# Altium project TRAFFIC LIGHT.PrjPCB
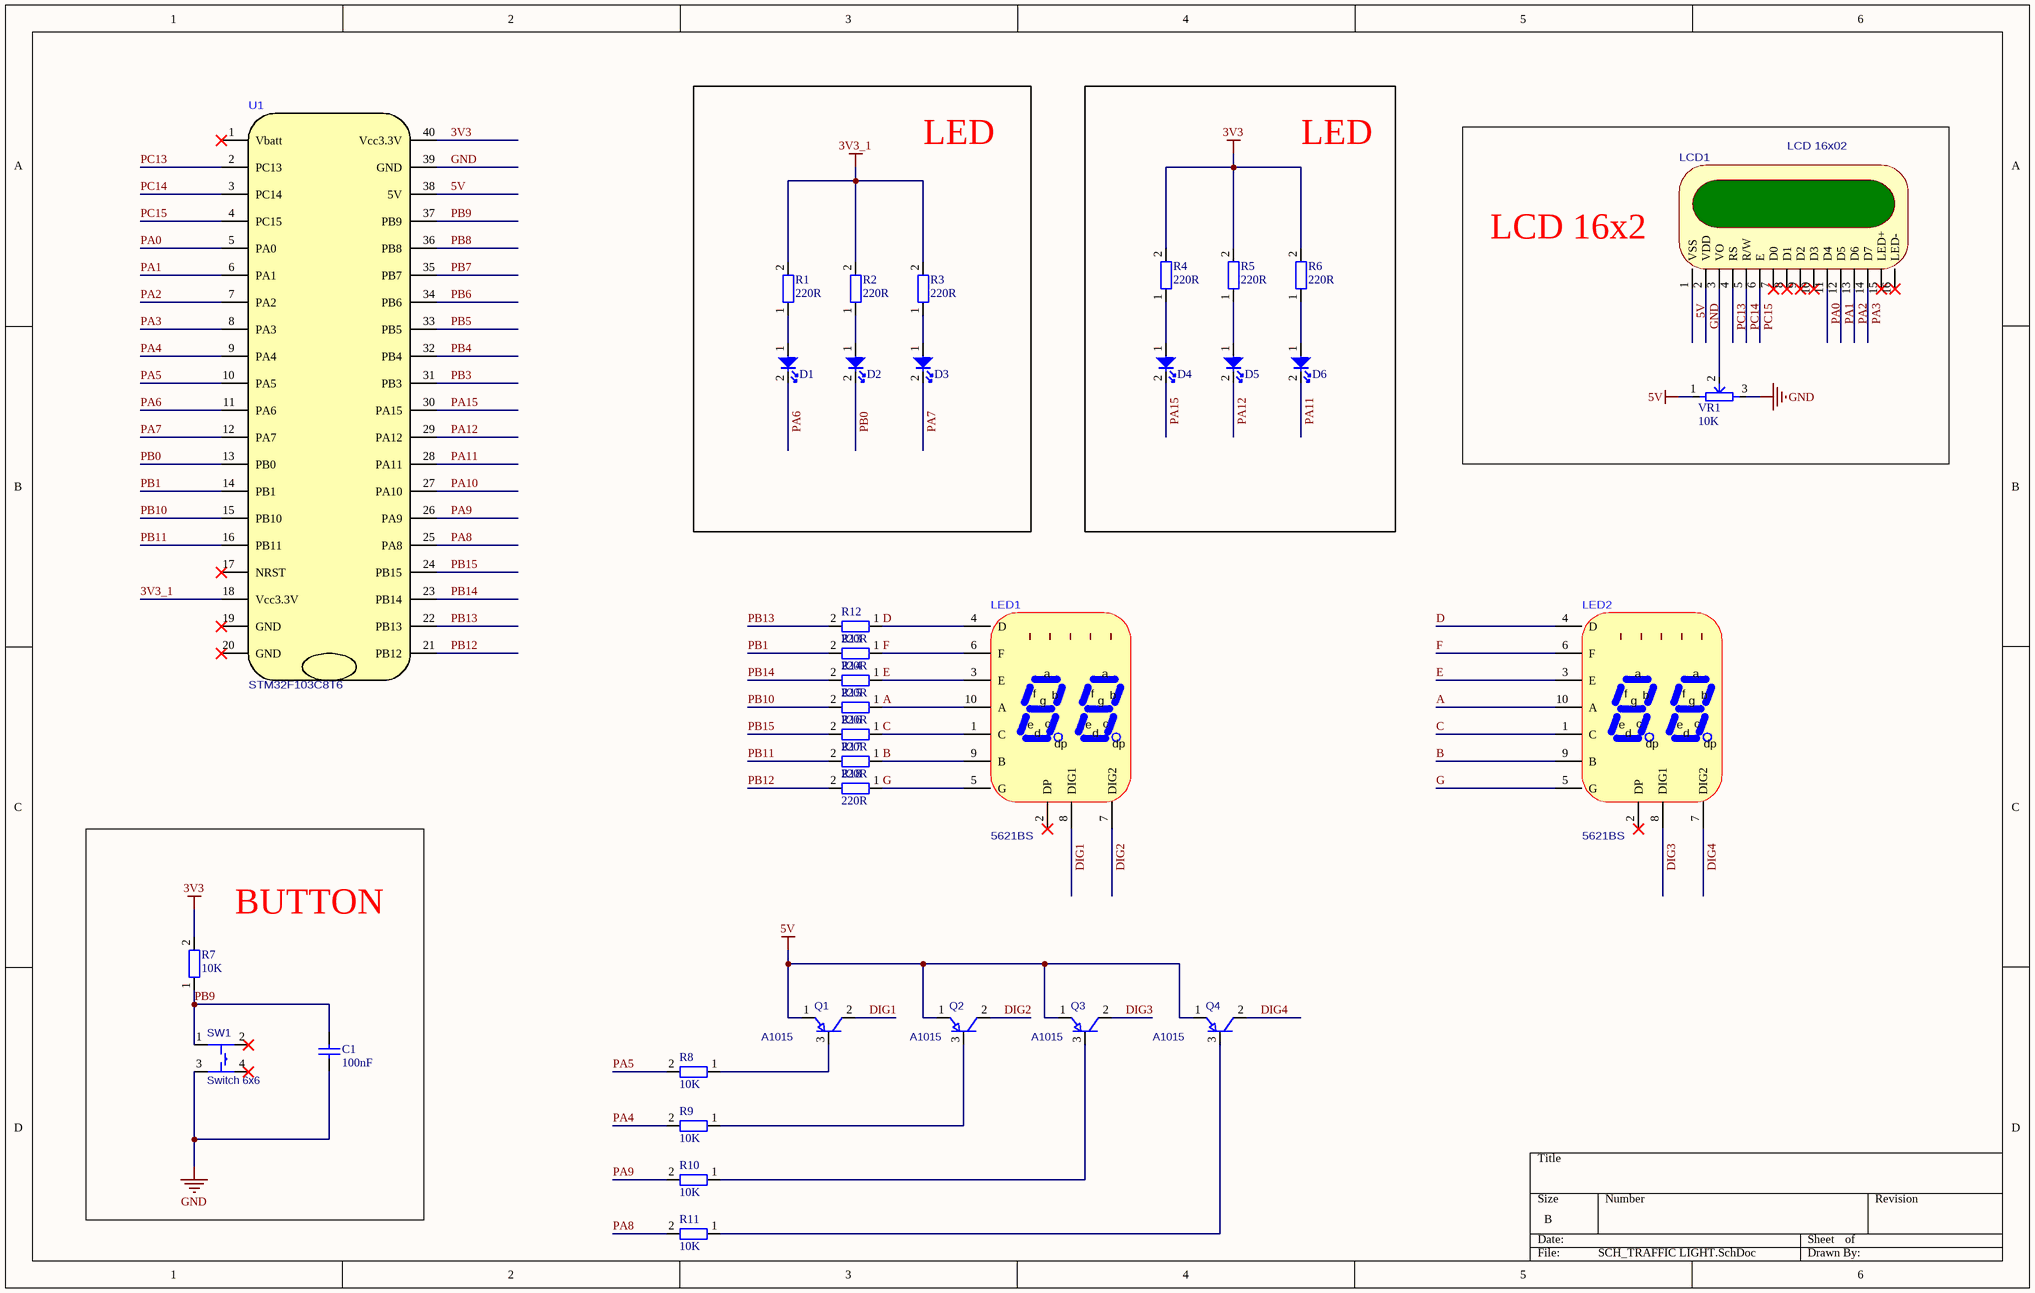
[diagram p0: SCH_TRAFFIC LIGHT.SchDoc]
1 sheet, 35 parts. Net scope: global (net labels, ports and power ports of the same name join across sheets).
Board file: PCB_TRAFFIC LIGHT.PcbDoc

## Sheet SCH_TRAFFIC LIGHT.SchDoc
size B

### Parts
C1  100nF  [CN1.5]
D1  LED  [LED-3]  (value not drawn)
D2  LED  [LED-3]  (value not drawn)
D3  LED  [LED-3]  (value not drawn)
D4  LED  [LED-3]  (value not drawn)
D5  LED  [LED-3]  (value not drawn)
D6  LED  [LED-3]  (value not drawn)
LCD1  LCD 16x02  [LCD DISPLAYS 16X2]
LED1  5621BS  [LED 7 SEG-2 0.56 inch]
LED2  5621BS  [LED 7 SEG-2 0.56 inch]
Q1  A1015  [TO-92]
Q2  A1015  [TO-92]
Q3  A1015  [TO-92]
Q4  A1015  [TO-92]
R1  220R  [RES CHIPS HOLD 1/4W TYPE 350MIL]
R2  220R  [RES CHIPS HOLD 1/4W TYPE 350MIL]
R3  220R  [RES CHIPS HOLD 1/4W TYPE 350MIL]
R4  220R  [RES CHIPS HOLD 1/4W TYPE 350MIL]
R5  220R  [RES CHIPS HOLD 1/4W TYPE 350MIL]
R6  220R  [RES CHIPS HOLD 1/4W TYPE 350MIL]
R7  10K  [RES CHIPS HOLD 1/4W TYPE 350MIL]
R8  10K  [RES CHIPS HOLD 1/4W TYPE 350MIL]
R9  10K  [RES CHIPS HOLD 1/4W TYPE 350MIL]
R10  10K  [RES CHIPS HOLD 1/4W TYPE 350MIL]
R11  10K  [RES CHIPS HOLD 1/4W TYPE 350MIL]
R12  220R  [RES CHIPS HOLD 1/4W TYPE 350MIL]
R13  220R  [RES CHIPS HOLD 1/4W TYPE 350MIL]
R14  220R  [RES CHIPS HOLD 1/4W TYPE 350MIL]
R15  220R  [RES CHIPS HOLD 1/4W TYPE 350MIL]
R16  220R  [RES CHIPS HOLD 1/4W TYPE 350MIL]
R17  220R  [RES CHIPS HOLD 1/4W TYPE 350MIL]
R18  220R  [RES CHIPS HOLD 1/4W TYPE 350MIL]
SW1  Switch 6x6  [SWITCHES TACTILE DIP 6X6x5 mm]
U1  STM32F103C8T6  [MODULE STM32F103C8T6]
VR1  10K  [RES VARIABLE HOLE 3362P]

### Nets
3V3: R4.2 R5.2 R6.2 R7.2 U1.40(Vcc3.3V)
3V3_1: R1.2 R2.2 R3.2 U1.18(Vcc3.3V)
5V: LCD1.1(VSS) Q1.1(E) Q2.1(E) Q3.1(E) Q4.1(E) U1.38(5V) VR1.1
GND: C1.2 LCD1.2(VDD) SW1.3 U1.39(GND) VR1.3
A: LED1.10(A) LED2.10(A) R15.1
B: LED1.9(B) LED2.9(B) R17.1
C: LED1.1(C) LED2.1(C) R16.1
D: LED1.4(D) LED2.4(D) R12.1
DIG1: LED1.8(DIG1) Q1.2(C)
DIG2: LED1.7(DIG2) Q2.2(C)
DIG3: LED2.8(DIG1) Q3.2(C)
DIG4: LED2.7(DIG2) Q4.2(C)
E: LED1.3(E) LED2.3(E) R14.1
F: LED1.6(F) LED2.6(F) R13.1
G: LED1.5(G) LED2.5(G) R18.1
PA0: LCD1.11(D4) U1.5(PA0)
PA1: LCD1.12(D5) U1.6(PA1)
PA2: LCD1.13(D6) U1.7(PA2)
PA3: LCD1.14(D7) U1.8(PA3)
PA4: R9.2 U1.9(PA4)
PA5: R8.2 U1.10(PA5)
PA6: D1.2 U1.11(PA6)
PA7: D3.2 U1.12(PA7)
PA8: R11.2 U1.25(PA8)
PA9: R10.2 U1.26(PA9)
PA10: U1.27(PA10)
PA11: D6.2 U1.28(PA11)
PA12: D5.2 U1.29(PA12)
PA15: D4.2 U1.30(PA15)
PB0: D2.2 U1.13(PB0)
PB1: R13.2 U1.14(PB1)
PB3: U1.31(PB3)
PB4: U1.32(PB4)
PB5: U1.33(PB5)
PB6: U1.34(PB6)
PB7: U1.35(PB7)
PB8: U1.36(PB8)
PB9: C1.1 R7.1 SW1.1 U1.37(PB9)
PB10: R15.2 U1.15(PB10)
PB11: R17.2 U1.16(PB11)
PB12: R18.2 U1.21(PB12)
PB13: R12.2 U1.22(PB13)
PB14: R14.2 U1.23(PB14)
PB15: R16.2 U1.24(PB15)
PC13: LCD1.4(RS) U1.2(PC13)
PC14: LCD1.5(R/W) U1.3(PC14)
PC15: LCD1.6(E) U1.4(PC15)
NetD1_1: D1.1 R1.1
NetD2_1: D2.1 R2.1
NetD3_1: D3.1 R3.1
NetD4_1: D4.1 R4.1
NetD5_1: D5.1 R5.1
NetD6_1: D6.1 R6.1
NetLCD1_3: LCD1.3(VO) VR1.2
NetQ1_3: Q1.3(B) R8.1
NetQ2_3: Q2.3(B) R9.1
NetQ3_3: Q3.3(B) R10.1
NetQ4_3: Q4.3(B) R11.1

Not connected (* = marked no-connect by the designer): LCD1 7(D0)* 8(D1)* 9(D2)* 10(D3)* 15(LED+)* 16(LED-)*; LED1 2(DP)*; LED2 2(DP)*; SW1 2* 4*; U1 1(Vbatt)* 17(NRST)* 19(GND)* 20(GND)*

### Notes on the sheet
- LED
- LCD 16x2
- (near R7) BUTTON
- (in symbol LCD DISPLAYS 16x02) 16x2
- (in symbol LED 7 SEG -2 0.56 inch) a; f; b; g; e; c; d; dp

### Library data of the parts
C1 = CAP 0805 50V 10%: 0805 Multilayer Ceramic Capacitors MLCC - SMD/SMT ROHS
D1-D6 = LED SMD 0805: Emerald 0805 Light Emitting Diodes (LED) ROHS; Supplier 1: RSComponents
LCD1 = LCD DISPLAYS 16x02: LCD Displays Modules 16x02 5V ROHS
LED1 LED2 = LED 7 SEG -2 0.56 inch
Q1-Q4 = TRANSISTOR HOLD PNP: BOM_Manufacturer: CJ(江苏长电/长晶); BOM_Manufacturer Part: 2SA1015-TA; Contributor: 立创EDA官方封装库; BOM_Supplier: LCSC; BOM_Supplier Part: C2084; BOM_JLCPCB Part Class: Extended Part; spicePre: Q; spiceSymbolName: 2SA1015-C2084
R1-R18 = RES HOLD 1%: Chung_Loai: Dán; Don_Vi: Con; So_Chan: 2; Ma_Hang: MH005880; Kieu_Chan: *
SW1 = SWITCHS TACTILE DIP 6x6mm: BOM_Manufacturer: OMRON(欧姆龙); BOM_Manufacturer Part: B3F-1000; Contributor: LCSC; BOM_Supplier: LCSC; BOM_Supplier Part: C93157; BOM_JLCPCB Part Class: Extended Part; spicePre: S; spiceSymbolName: B3F-1000
U1 = MODULE STM32F103C8T6
VR1 = RES VARIABLE HOLD 3P: Plugin Variable Resistors/Potentiometers ROHS; Ma_Hang: MH000919; Don_Vi: Con; Ten_Linh_Kien: Biến Trở Tam Giác 103-10K RM065 (Chân Đứng); Chung_Loai: Cắm; Kieu_Chan: *